# EAGLE design GDEnvSensorNode_Programmer (EAGLE 8.3.2)
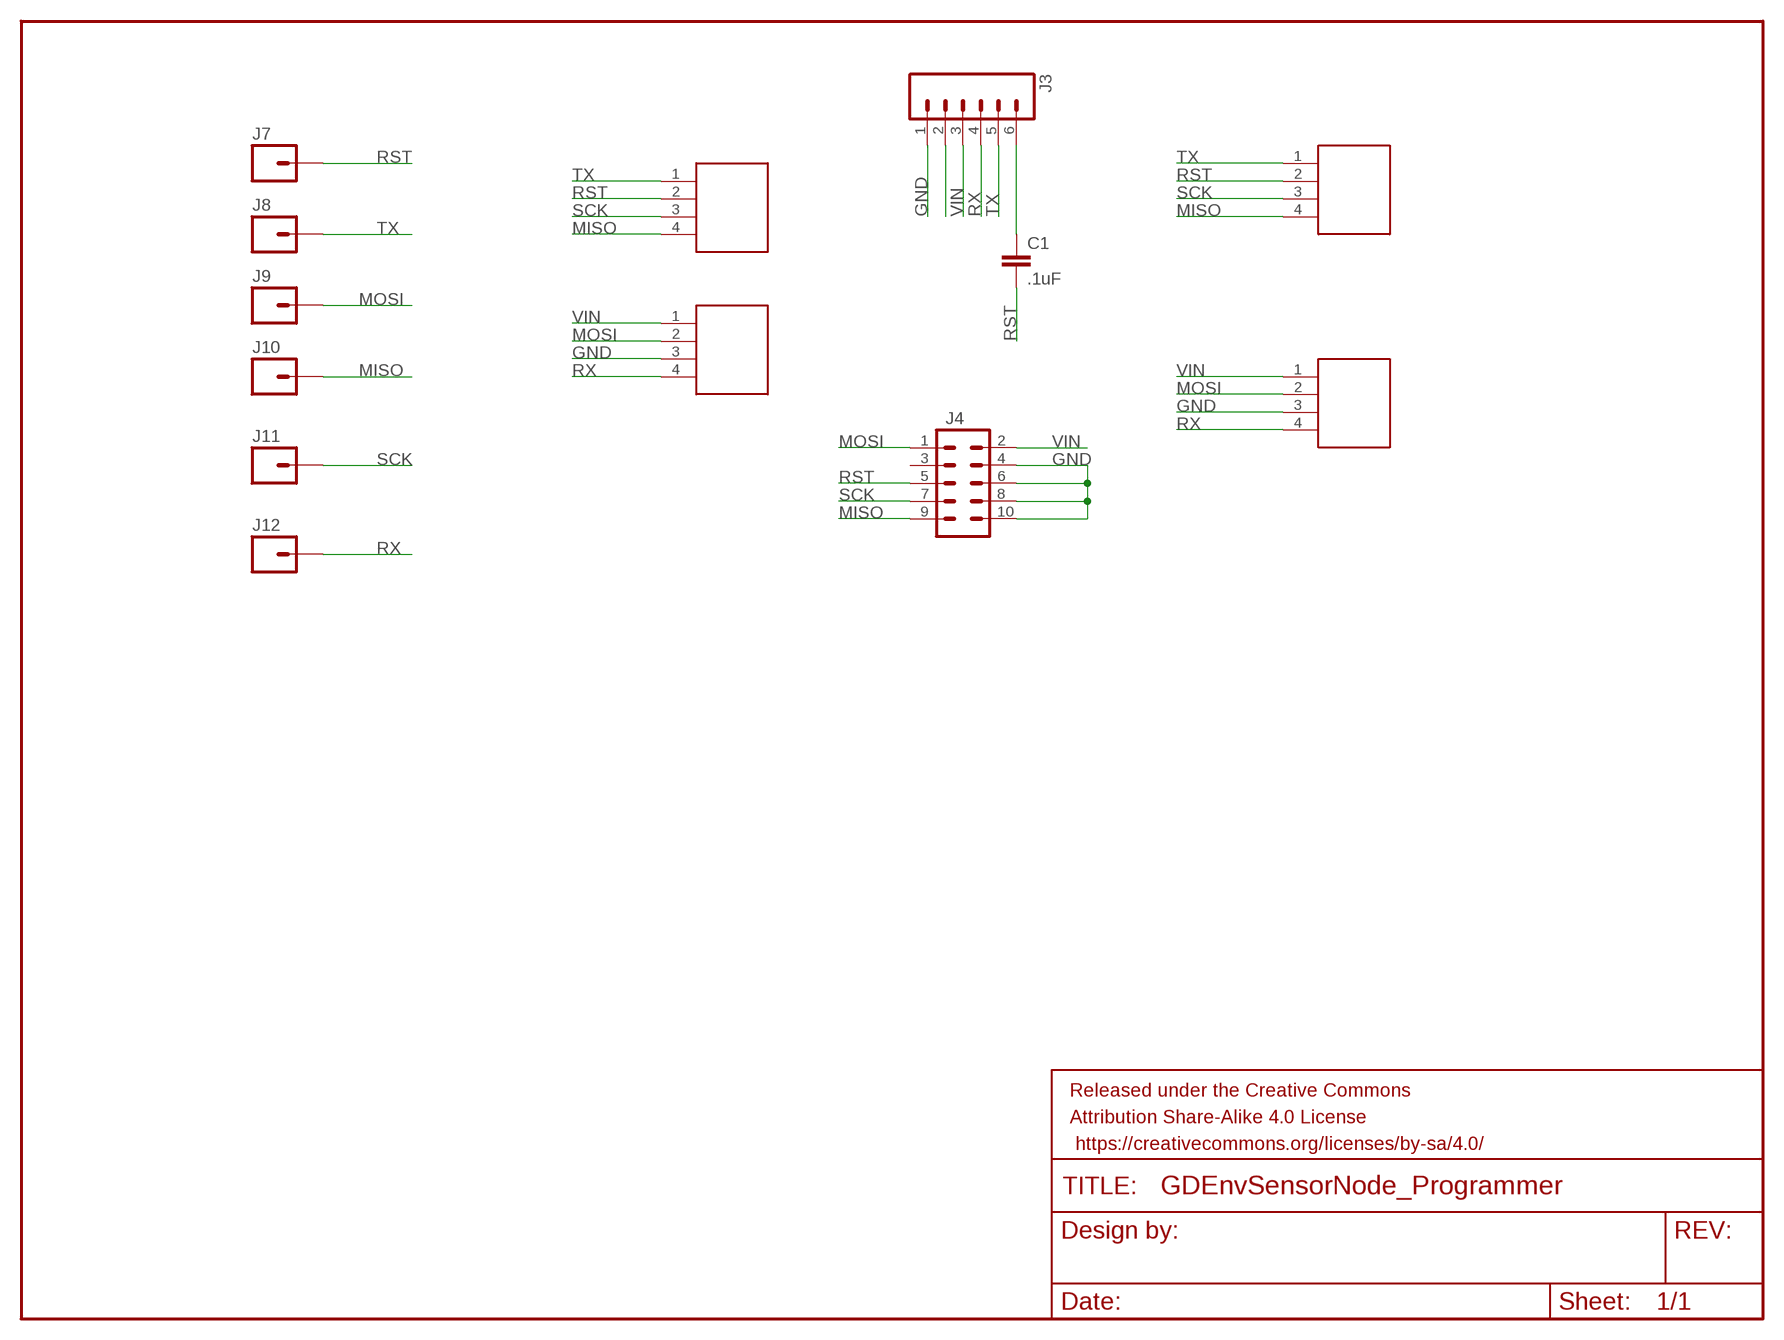
[diagram p0: schematic, sheet 1]

## Parts
C1  .1uF  CAP0805  [0805]
FRAME1  FRAME-LETTER  [CREATIVE_COMMONS]
J1  4X.1IN_POGO_PIN  [4X.1IN_POGO_PIN]
J2  4X.1IN_POGO_PIN  [4X.1IN_POGO_PIN]
J3  M06LONGPADS  [1X06_LONGPADS]
J4  M05X2PTH  [AVR_ICSP]
J5  4X.1IN_POGO_PIN  [4X.1IN_POGO_PIN]
J6  4X.1IN_POGO_PIN  [4X.1IN_POGO_PIN]
J7  M01PTH  [1X01]
J8  M01PTH  [1X01]
J9  M01PTH  [1X01]
J10  M01PTH  [1X01]
J11  M01PTH  [1X01]
J12  M01PTH  [1X01]

## Nets
GND: J2.3 J3.1 J4.4 J4.6 J4.8 J4.10 J6.3
MISO: J1.4 J4.9 J5.4 J10.1
MOSI: J2.2 J4.1 J6.2 J9.1
N$1: C1.1 J3.6
N$14: J3.2
RST: C1.2 J1.2 J4.5 J5.2 J7.1
RX: J2.4 J3.4 J6.4 J12.1
SCK: J1.3 J4.7 J5.3 J11.1
TX: J1.1 J3.5 J5.1 J8.1
VIN: J2.1 J3.3 J4.2 J6.1
Unconnected: J4.3

## Library data of the parts
C1 = SparkFun-Capacitors:CAP: Capacitor Standard 0603 ceramic capacitor, and 0.1" leaded capacitor.
FRAME1 = SparkFun-Aesthetics:FRAME-LETTER: Schematic Frame Standard 8.5x11 US Letter frame
J1 J2 J5 J6 = GDTech:4X.1IN_POGO_PIN: 4x.1in spacing 1.02mm diameter pogo pins P75-B1 Dia 1.02mm 100g Spring Test Probe Pogo Pin found on eBay.
J3 = SparkFun-Connectors:M06: Header 6 Standard 6-pin 0.1" header. Use with straight break away headers (SKU : PRT-00116), right angle break away headers (PRT-00553), swiss pins (PRT-00743), machine pins (PRT-00117), and female headers (PRT-00115). Molex polarized connector foot print use with SKU : PRT-08094 with associated crimp pins and housings. NOTES ON THE VARIANTS LOCK and LOCK_LONGPADS... This footprint was designed to help hold the alignment of a through-hole component (i.e. 6-pin header) while soldering it into place. You may notice that each hole has been shifted either up or down by 0.005 of an inch from it's more standard position (which is a perfectly straight line). This slight alteration caused the pins (the squares in the middle) to touch the edges of the holes. Because they are alternating, it causes a "brace" to hold the component in place. 0.005 has proven to be the perfect amount of "off-center" position when using our standard breakaway headers. Although looks a little odd when you look at the bare footprint, once you have a header in there, the alteration is very hard to notice. Also,if you push a header all the way into place, it is covered up entirely on the bottom side. This idea of altering the position of holes to aid alignment will be further integrated into the Sparkfun Library for other footprints. It can help hold any component with 3 or more connection pins.
J4 = SparkFun-Connectors:M05X2: Header 5x2 Standard 10-pin dual row 0.1" header. Commonly used with AVR-ISP. Use with Spark Fun Electronics SKU: PRT-00778
J7-J12 = SparkFun-Connectors:M01: Header 1 Standard 1-pin 0.1" header. Use with straight break away headers (SKU : PRT-00116), right angle break away headers (PRT-00553), swiss pins (PRT-00743), machine pins (PRT-00117), and female headers (PRT-00115). SMTSO-256-ET is a "flush mount" nut for a 4-40 screw. The older package used to be too tight, and did not allow it to sit properly thru the drill hit. The latest (0.165DIA) fits nice and snug.

## Board
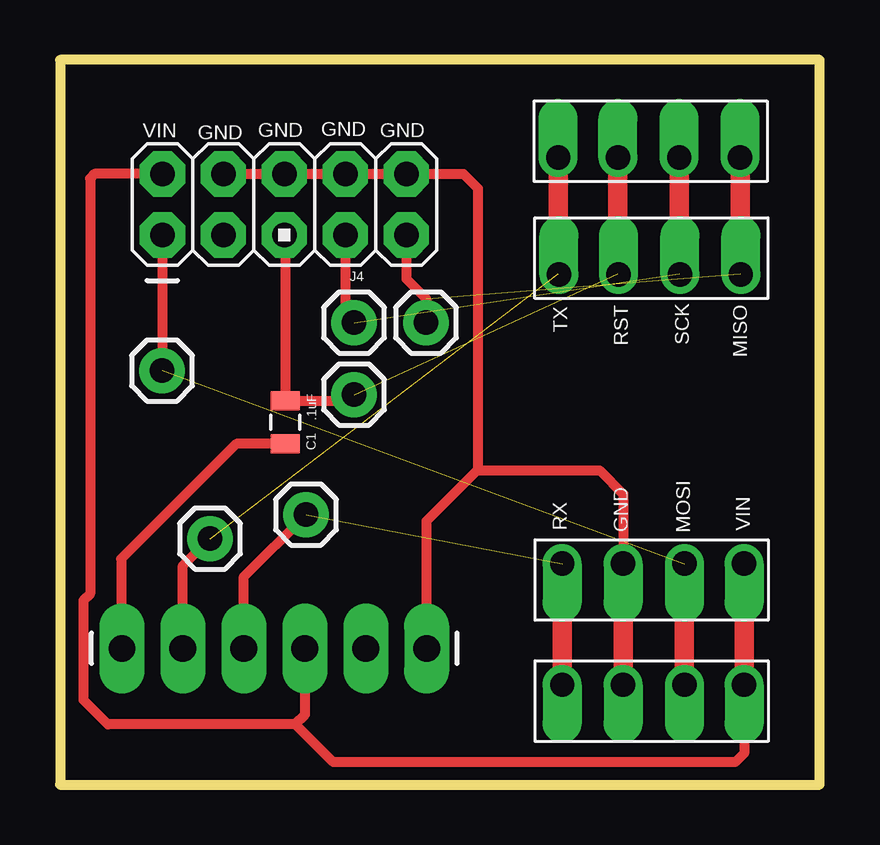
[diagram p1: board, top side]

Size 31.65 x 30.19 mm. Coordinates in mm from the lower left corner, seen from the top.
Outline: 0,0 31.65,0 31.65,30.19 0,30.19 0,0
Copper layers (1*16): Top 0.035mm / dielectric 1.5mm / Bottom 0.035mm
Design rules "SparkFun": minimum track width 8mil, minimum drill 20mil, track to track 8mil, track to pad 8mil, pad to pad 8mil, via to via 8mil, smd to smd 8mil, copper to edge 8mil, drill to drill 8mil, minimum pad ring 12mil, minimum via ring 10mil, stop-mask expansion 4mil, vias tented up to drill 20mil, thermal gap 10mil

### Footprints (pad centres in the part's own frame; a part is rotated, then mirrored left to right if it is on the bottom)
0805 = smd 0.8 x 1.2: 1 -0.9,0; 2 0.9,0
4X.1IN_POGO_PIN = drill 1.016 pad 1.422 offset: 1 0,9.27; 2 0,6.787; 3 0,4.229; 4 0,1.695
1X06_LONGPADS = drill 1.118 pad 1.88 long: 1 0,0; 2 2.54,0; 3 5.08,0; 4 7.62,0; 5 10.16,0; 6 12.7,0
AVR_ICSP = drill 1.016 pad 1.88 octagon: 1 -1.27,5.08; 2 1.27,5.08; 3 -1.27,2.54; 4 1.27,2.54; 5 -1.27,0; 6 1.27,0; 7 -1.27,-2.54; 8 1.27,-2.54; 9 -1.27,-5.08; 10 1.27,-5.08
1X01 = drill 1.016 pad 1.88: 1 0,0

### Placement (x,y rotation side)
C1  9.38,15.1 90 top
FRAME1  22.84,-8.64 0 top  (outside the outline)
J1  30.06,21.25 90 top
J2  19.23,9.21 270 top
J3  15.28,5.67 180 top
J4  9.35,24.17 90 top
J5  30.03,26.12 90 top
J6  19.23,4.16 270 top
J7  12.25,16.25 0 top
J8  6.25,10.25 0 top
J9  4.25,17.25 0 top
J10  15.25,19.25 0 top
J11  12.25,19.25 0 top
J12  10.25,11.25 0 top

### Tracks (layer width: path | path; a pad name or v marks a point on that pad's centre or on a via)
GND
  Top 0.406: J4.4 J4.6 J4.8 J4.10 16.81,25.44 17.41,24.84 17.41,13.12 17.38,13.09 | J3.1 15.28,10.99 17.38,13.09 | 17.38,13.09 22.48,13.09 23.47,12.1 J2.3
  Top 0.813: J2.3 J6.3
MISO  (1 unrouted)
  Top 0.406: J4.9 14.43,21.07 15.25,20.25 J10.1
  Top 0.813: J5.4 28.34,21.28 J1.4
MOSI  (1 unrouted)
  Top 0.406: J4.1 4.27,17.27 J9.1
  Top 0.813: J2.2 J6.2
N$1
  Top 0.406: C1.1 7.34,14.2 2.55,9.4 2.55,5.7 J3.6
RST  (1 unrouted)
  Top 0.406: J4.5 9.38,22.87 C1.2 11.99,15.99 J7.1
  Top 0.813: J5.2 23.24,21.28 J1.2
RX  (1 unrouted)
  Top 0.406: J3.4 7.66,8.66 J12.1
  Top 0.813: J2.4 J6.4
SCK  (1 unrouted)
  Top 0.406: J4.7 11.89,19.61 J11.1
  Top 0.813: J5.3 25.8,21.28 J1.3
TX  (1 unrouted)
  Top 0.406: J3.5 5.12,9.12 J8.1
  Top 0.813: J5.1 20.76,21.28 J1.1
VIN
  Top 0.406: J4.2 1.44,25.44 1.25,25.25 1.25,7.95 0.97,7.67 0.97,3.53 1.99,2.51 9.81,2.51 | 9.81,2.51 10.21,2.91 J3.3 | J6.1 28.5,1.3 28.13,0.93 11.39,0.93 9.81,2.51
  Top 0.813: J2.1 J6.1

### Text on the board
tPlace: VIN | GND | GND | GND | GND | TX | RST | SCK | MISO | RX | GND | MOSI | VIN